# EAGLE design led driver2 (EAGLE 6.2)
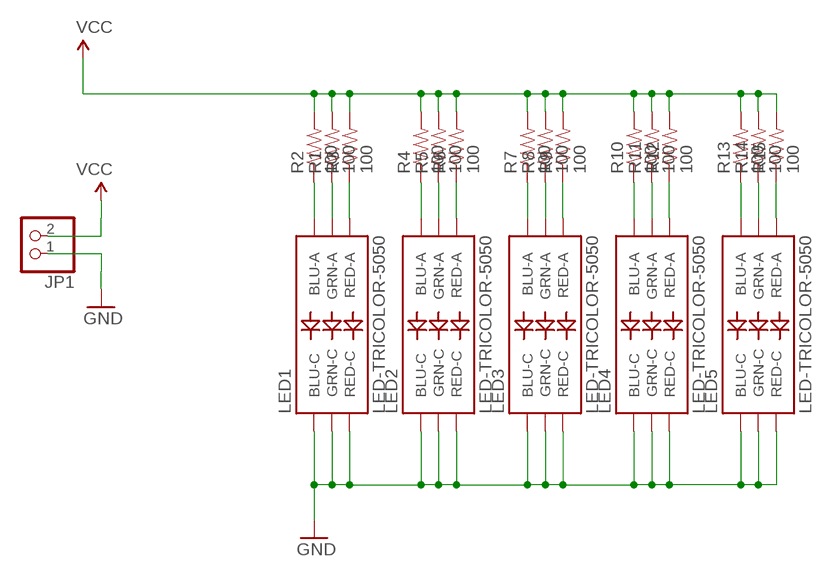
[diagram p0: schematic, sheet 1]

## Parts
JP1  PINHD-1X2  [1X02]
LED1  LED-TRICOLOR-5050  [LED-TRICOLOR-5050]
LED2  LED-TRICOLOR-5050  [LED-TRICOLOR-5050]
LED3  LED-TRICOLOR-5050  [LED-TRICOLOR-5050]
LED4  LED-TRICOLOR-5050  [LED-TRICOLOR-5050]
LED5  LED-TRICOLOR-5050  [LED-TRICOLOR-5050]
R1  100  RESISTOR0603-RES  [0603-RES]
R2  100  RESISTOR0603-RES  [0603-RES]
R3  100  RESISTOR0603-RES  [0603-RES]
R4  100  RESISTOR0603-RES  [0603-RES]
R5  100  RESISTOR0603-RES  [0603-RES]
R6  100  RESISTOR0603-RES  [0603-RES]
R7  100  RESISTOR0603-RES  [0603-RES]
R8  100  RESISTOR0603-RES  [0603-RES]
R9  100  RESISTOR0603-RES  [0603-RES]
R10  100  RESISTOR0603-RES  [0603-RES]
R11  100  RESISTOR0603-RES  [0603-RES]
R12  100  RESISTOR0603-RES  [0603-RES]
R13  100  RESISTOR0603-RES  [0603-RES]
R14  100  RESISTOR0603-RES  [0603-RES]
R15  100  RESISTOR0603-RES  [0603-RES]

## Nets
GND: JP1.1 LED1.4(BLU-C) LED1.5(RED-C) LED1.6(GRN-C) LED2.4(BLU-C) LED2.5(RED-C) LED2.6(GRN-C) LED3.4(BLU-C) LED3.5(RED-C) LED3.6(GRN-C) LED4.4(BLU-C) LED4.5(RED-C) LED4.6(GRN-C) LED5.4(BLU-C) LED5.5(RED-C) LED5.6(GRN-C)
N$1: LED2.3(BLU-A) R4.1
N$2: LED2.1(GRN-A) R5.1
N$3: LED2.2(RED-A) R6.1
N$4: LED3.3(BLU-A) R7.1
N$5: LED3.1(GRN-A) R8.1
N$6: LED3.2(RED-A) R9.1
N$7: LED4.3(BLU-A) R10.1
N$8: LED4.1(GRN-A) R11.1
N$9: LED4.2(RED-A) R12.1
N$10: LED5.3(BLU-A) R13.1
N$11: LED5.1(GRN-A) R14.1
N$12: LED5.2(RED-A) R15.1
N$20: LED1.3(BLU-A) R2.1
N$21: LED1.1(GRN-A) R1.1
N$22: LED1.2(RED-A) R3.1
VCC: JP1.2 R1.2 R2.2 R3.2 R4.2 R5.2 R6.2 R7.2 R8.2 R9.2 R10.2 R11.2 R12.2 R13.2 R14.2 R15.2

## Library data of the parts
JP1 = pinhead:PINHD-1X2: PIN HEADER
LED1-LED5 = SparkFun:LED-TRICOLOR-5050
R1-R15 = SparkFun:RESISTOR: Resistor Basic schematic elements and footprints for 0603, 1206, and PTH resistors.

## Board
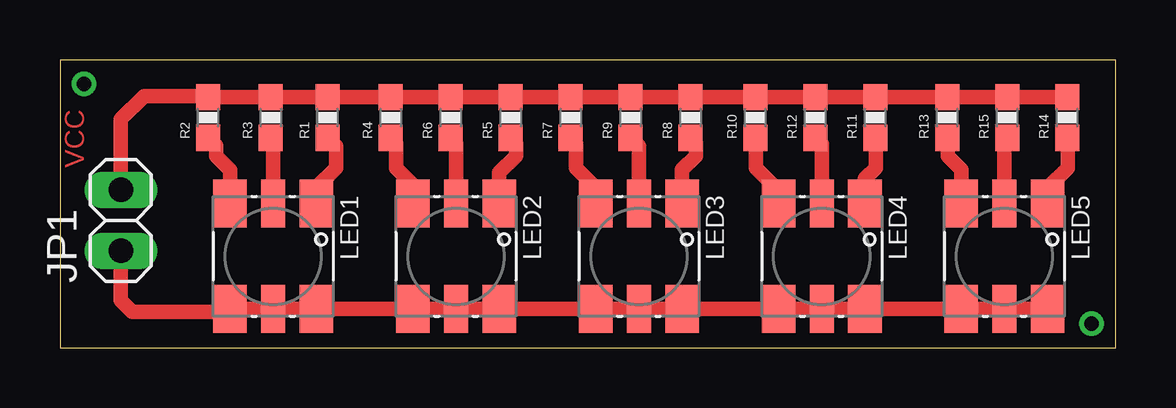
[diagram p1: board, top side]

Size 44 x 12 mm. Coordinates in mm from the lower left corner, seen from the top.
Outline: 0,0 44,0 44,12 0,12 0,0
Copper layers (1*16): Top 0.035mm / dielectric 1.5mm / Bottom 0.035mm
Design rules: minimum track width 10mil, minimum drill 24mil, track to track 8mil, track to pad 8mil, pad to pad 8mil, via to via 8mil, smd to smd 8mil, copper to edge 40mil, drill to drill 8mil, minimum pad ring 10mil, minimum via ring 8mil, stop-mask expansion 4mil, vias tented up to drill 0mil, thermal gap 10mil

### Footprints (pad centres in the part's own frame; a part is rotated, then mirrored left to right if it is on the bottom)
1X02 = drill 1.016 long: 1 -1.27,0; 2 1.27,0
LED-TRICOLOR-5050 = smd 2 x 1.4: 1 -2.2,1.8; 3 -2.2,-1.8; 4 2.2,-1.8; 6 2.2,1.8 | smd 2 x 1: 2 -2.2,0; 5 2.2,0
0603-RES = smd 1.1 x 1: 1 -0.85,0; 2 0.85,0

### Placement (x,y rotation side)
JP1  2.54,5.31 90 top
LED1  8.89,3.81 270 top
LED2  16.51,3.81 270 top
LED3  24.13,3.81 270 top
LED4  31.75,3.81 270 top
LED5  39.37,3.81 270 top
R1  11.16,9.6 90 top
R2  6.18,9.6 90 top
R3  8.79,9.6 90 top
R4  13.79,9.6 90 top
R5  18.79,9.6 90 top
R6  16.29,9.6 90 top
R7  21.29,9.6 90 top
R8  26.29,9.6 90 top
R9  23.79,9.6 90 top
R10  28.98,9.6 90 top
R11  33.98,9.6 90 top
R12  31.48,9.6 90 top
R13  36.98,9.6 90 top
R14  41.98,9.6 90 top
R15  39.48,9.6 90 top

### Tracks (layer width: path | path; a pad name or v marks a point on that pad's centre or on a via)
GND
  Top 0.61: JP1.1 2.54,1.96 3,1.5 6.98,1.5 LED1.4 LED1.5 LED1.6 LED2.4 LED2.5 LED2.6 LED3.4 LED3.5 LED3.6 LED4.4 LED4.5 LED4.6 LED5.4 LED5.5 LED5.6
N$1
  Top 0.61: LED2.3 14.71,6.79 14,7.5 14,8.54 R4.1
N$2
  Top 0.61: LED2.1 18.31,7.31 19,8 19,8.54 R5.1
N$3
  Top 0.61: LED2.2 16.51,7.99 16.5,8 16.5,8.54 R6.1
N$4
  Top 0.61: LED3.3 22.33,6.67 21.5,7.5 21.5,8.54 R7.1
N$5
  Top 0.61: LED3.1 25.93,7.43 26.5,8 26.5,8.54 R8.1
N$6
  Top 0.61: LED3.2 24.13,8.41 R9.1
N$7
  Top 0.61: LED4.3 29.95,6.55 29,7.5 29,8.73 R10.1
N$8
  Top 0.61: LED4.1 33.55,7.05 34,7.5 34,8.73 R11.1
N$9
  Top 0.61: LED4.2 31.75,8.48 R12.1
N$10
  Top 0.61: LED5.3 37.57,7.43 37,8 37,8.73 R13.1
N$11
  Top 0.61: LED5.1 41.17,6.67 42,7.5 42,8.73 R14.1
N$12
  Top 0.61: LED5.2 39.37,8.64 R15.1
N$13  (via drill 0.6)
  other vias: 43,1
N$14  (via drill 0.6)
  other vias: 1,11
N$20
  Top 0.61: LED1.3 7.09,7.41 6.5,8 6.5,8.43 R2.1
N$21
  Top 0.61: LED1.1 10.69,6.69 11.5,7.5 11.5,8.41 R1.1
N$22
  Top 0.61: LED1.2 8.89,8.65 R3.1
VCC
  Top 0.61: JP1.2 2.54,9.54 3.5,10.5 6.13,10.5 R2.2 R3.2 R1.2 R4.2 R6.2 R5.2 R7.2 R9.2 R8.2 R10.2 R12.2 R11.2 R13.2 R15.2 R14.2

### Text on the board
Top: VCC